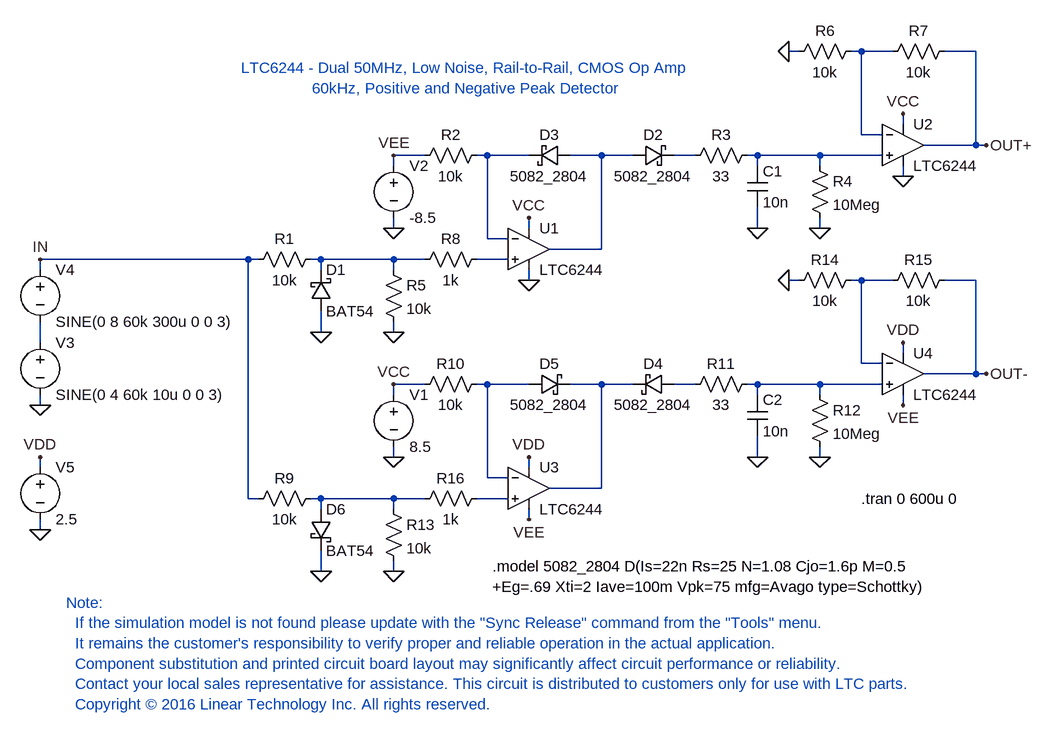
[diagram p0: schematic LTC6244_60kHz_PeakHold_Pos_and_Neg.asc]
LTC6244_60kHz_PeakHold_Pos_and_Neg.asc, the LTspice schematic file:
Version 4
SHEET 1 880 1728
WIRE -912 416 -928 416
WIRE -816 416 -832 416
WIRE -768 416 -816 416
WIRE -640 416 -688 416
WIRE -752 528 -752 512
WIRE -816 544 -816 416
WIRE -784 544 -816 544
WIRE -640 560 -640 416
WIRE -640 560 -720 560
WIRE -624 560 -640 560
WIRE -1488 576 -1536 576
WIRE -1392 576 -1408 576
WIRE -1328 576 -1392 576
WIRE -1216 576 -1264 576
WIRE -1168 576 -1216 576
WIRE -1072 576 -1104 576
WIRE -976 576 -992 576
WIRE -880 576 -976 576
WIRE -784 576 -880 576
WIRE -1536 592 -1536 576
WIRE -976 592 -976 576
WIRE -880 592 -880 576
WIRE -752 608 -752 592
WIRE -1536 688 -1536 672
WIRE -1328 688 -1328 672
WIRE -976 688 -976 656
WIRE -880 688 -880 672
WIRE -1392 704 -1392 576
WIRE -1360 704 -1392 704
WIRE -1216 720 -1216 576
WIRE -1216 720 -1296 720
WIRE -1760 736 -2080 736
WIRE -1744 736 -1760 736
WIRE -1648 736 -1664 736
WIRE -1536 736 -1648 736
WIRE -1488 736 -1536 736
WIRE -1360 736 -1408 736
WIRE -2080 752 -2080 736
WIRE -1648 752 -1648 736
WIRE -1536 752 -1536 736
WIRE -1328 768 -1328 752
WIRE -912 768 -928 768
WIRE -816 768 -832 768
WIRE -768 768 -816 768
WIRE -640 768 -688 768
WIRE -1648 848 -1648 816
WIRE -1536 848 -1536 832
WIRE -2080 864 -2080 832
WIRE -752 880 -752 864
WIRE -816 896 -816 768
WIRE -784 896 -816 896
WIRE -640 912 -640 768
WIRE -640 912 -720 912
WIRE -624 912 -640 912
WIRE -1488 928 -1536 928
WIRE -1392 928 -1408 928
WIRE -1328 928 -1392 928
WIRE -1216 928 -1264 928
WIRE -1168 928 -1216 928
WIRE -1072 928 -1104 928
WIRE -976 928 -992 928
WIRE -880 928 -976 928
WIRE -784 928 -880 928
WIRE -1536 944 -1536 928
WIRE -976 944 -976 928
WIRE -880 944 -880 928
WIRE -2080 960 -2080 944
WIRE -752 960 -752 944
WIRE -1536 1040 -1536 1024
WIRE -976 1040 -976 1008
WIRE -880 1040 -880 1024
WIRE -2080 1056 -2080 1040
WIRE -1328 1056 -1328 1040
WIRE -1392 1072 -1392 928
WIRE -1360 1072 -1392 1072
WIRE -1216 1088 -1216 928
WIRE -1216 1088 -1296 1088
WIRE -1760 1104 -1760 736
WIRE -1744 1104 -1760 1104
WIRE -1648 1104 -1664 1104
WIRE -1536 1104 -1648 1104
WIRE -1488 1104 -1536 1104
WIRE -1360 1104 -1408 1104
WIRE -1648 1120 -1648 1104
WIRE -1536 1120 -1536 1104
WIRE -1328 1136 -1328 1120
WIRE -2080 1152 -2080 1136
WIRE -1648 1216 -1648 1184
WIRE -1536 1216 -1536 1200
FLAG -1536 1040 0
FLAG -1328 768 0
FLAG -1328 672 VCC
FLAG -2080 960 0
FLAG -1648 848 0
FLAG -1536 848 0
FLAG -976 688 0
FLAG -880 688 0
FLAG -1536 576 VEE
FLAG -752 608 0
FLAG -752 512 VCC
FLAG -928 416 0
FLAG -1648 1216 0
FLAG -1536 1216 0
FLAG -976 1040 0
FLAG -880 1040 0
FLAG -928 768 0
FLAG -1328 1136 VEE
FLAG -752 960 VEE
FLAG -1536 928 VCC
FLAG -624 560 OUT+
FLAG -624 912 OUT-
FLAG -2080 736 IN
FLAG -2080 1040 VDD
FLAG -1328 1040 VDD
FLAG -752 864 VDD
FLAG -1536 688 0
FLAG -2080 1152 0
SYMBOL voltage -1536 928 R0
WINDOW 123 24 138 Left 2
WINDOW 39 24 117 Left 2
SYMATTR InstName V1
SYMATTR Value 8.5
SYMBOL voltage -1536 576 R0
WINDOW 123 24 138 Left 2
WINDOW 39 24 117 Left 2
SYMATTR InstName V2
SYMATTR Value -8.5
SYMBOL voltage -2080 848 R0
WINDOW 123 0 0 Left 2
WINDOW 39 0 0 Left 2
SYMATTR InstName V3
SYMATTR Value SINE(0 4 60k 10u 0 0 3)
SYMBOL res -1648 720 R90
WINDOW 0 0 56 VBottom 2
WINDOW 3 32 56 VTop 2
SYMATTR InstName R1
SYMATTR Value 10k
SYMBOL LTC6244 -1328 720 R0
SYMATTR InstName U1
SYMBOL cap -992 592 R0
SYMATTR InstName C1
SYMATTR Value 10n
SYMBOL res -1392 560 R90
WINDOW 0 0 56 VBottom 2
WINDOW 3 32 56 VTop 2
SYMATTR InstName R2
SYMATTR Value 10k
SYMBOL res -976 560 R90
WINDOW 0 0 56 VBottom 2
WINDOW 3 32 56 VTop 2
SYMATTR InstName R3
SYMATTR Value 33
SYMBOL res -896 576 R0
SYMATTR InstName R4
SYMATTR Value 10Meg
SYMBOL schottky -1664 816 M180
WINDOW 0 24 64 Left 2
WINDOW 3 24 0 Left 2
SYMATTR InstName D1
SYMATTR Value BAT54
SYMATTR Description Diode
SYMATTR Type diode
SYMBOL schottky -1168 592 R270
WINDOW 0 32 32 VTop 2
WINDOW 3 0 32 VBottom 2
SYMATTR InstName D2
SYMATTR Value 5082_2804
SYMATTR Description Diode
SYMATTR Type diode
SYMBOL schottky -1264 560 R90
WINDOW 0 0 32 VBottom 2
WINDOW 3 32 32 VTop 2
SYMATTR InstName D3
SYMATTR Value 5082_2804
SYMATTR Description Diode
SYMATTR Type diode
SYMBOL res -1552 736 R0
SYMATTR InstName R5
SYMATTR Value 10k
SYMBOL LTC6244 -752 560 R0
SYMATTR InstName U2
SYMBOL res -816 400 R90
WINDOW 0 0 56 VBottom 2
WINDOW 3 32 56 VTop 2
SYMATTR InstName R6
SYMATTR Value 10k
SYMBOL res -672 400 R90
WINDOW 0 0 56 VBottom 2
WINDOW 3 32 56 VTop 2
SYMATTR InstName R7
SYMATTR Value 10k
SYMBOL res -1504 752 R270
WINDOW 0 32 56 VTop 2
WINDOW 3 0 56 VBottom 2
SYMATTR InstName R8
SYMATTR Value 1k
SYMBOL voltage -2080 736 R0
WINDOW 123 0 0 Left 2
WINDOW 39 0 0 Left 2
SYMATTR InstName V4
SYMATTR Value SINE(0 8 60k 300u 0 0 3)
SYMBOL res -1648 1088 R90
WINDOW 0 0 56 VBottom 2
WINDOW 3 32 56 VTop 2
SYMATTR InstName R9
SYMATTR Value 10k
SYMBOL cap -992 944 R0
SYMATTR InstName C2
SYMATTR Value 10n
SYMBOL res -1392 912 R90
WINDOW 0 0 56 VBottom 2
WINDOW 3 32 56 VTop 2
SYMATTR InstName R10
SYMATTR Value 10k
SYMBOL res -976 912 R90
WINDOW 0 0 56 VBottom 2
WINDOW 3 32 56 VTop 2
SYMATTR InstName R11
SYMATTR Value 33
SYMBOL res -896 928 R0
SYMATTR InstName R12
SYMATTR Value 10Meg
SYMBOL schottky -1104 912 R90
WINDOW 0 0 32 VBottom 2
WINDOW 3 32 32 VTop 2
SYMATTR InstName D4
SYMATTR Value 5082_2804
SYMATTR Description Diode
SYMATTR Type diode
SYMBOL schottky -1328 944 R270
WINDOW 0 32 32 VTop 2
WINDOW 3 0 32 VBottom 2
SYMATTR InstName D5
SYMATTR Value 5082_2804
SYMATTR Description Diode
SYMATTR Type diode
SYMBOL res -1552 1104 R0
SYMATTR InstName R13
SYMATTR Value 10k
SYMBOL res -816 752 R90
WINDOW 0 0 56 VBottom 2
WINDOW 3 32 56 VTop 2
SYMATTR InstName R14
SYMATTR Value 10k
SYMBOL res -672 752 R90
WINDOW 0 0 56 VBottom 2
WINDOW 3 32 56 VTop 2
SYMATTR InstName R15
SYMATTR Value 10k
SYMBOL res -1504 1120 R270
WINDOW 0 32 56 VTop 2
WINDOW 3 0 56 VBottom 2
SYMATTR InstName R16
SYMATTR Value 1k
SYMBOL schottky -1664 1120 R0
SYMATTR InstName D6
SYMATTR Value BAT54
SYMATTR Description Diode
SYMATTR Type diode
SYMBOL LTC6244 -1328 1088 R0
SYMATTR InstName U3
SYMBOL LTC6244 -752 912 R0
SYMATTR InstName U4
SYMBOL voltage -2080 1040 R0
WINDOW 123 0 0 Left 2
WINDOW 39 0 0 Left 2
SYMATTR InstName V5
SYMATTR Value 2.5
TEXT -816 1104 Left 2 !.tran 0 600u 0
TEXT -1384 1208 Left 2 !.model 5082_2804 D(Is=22n Rs=25 N=1.08 Cjo=1.6p M=0.5 \n+Eg=.69 Xti=2 Iave=100m Vpk=75 mfg=Avago type=Schottky)
TEXT -2040 1264 Left 2 ;Note:\n  If the simulation model is not found please update with the "Sync Release" command from the "Tools" menu.\n  It remains the customer's responsibility to verify proper and reliable operation in the actual application.\n  Component substitution and printed circuit board layout may significantly affect circuit performance or reliability.\n  Contact your local sales representative for assistance. This circuit is distributed to customers only for use with LTC parts.\n  Copyright © 2016 Linear Technology Inc. All rights reserved.
TEXT -1424 488 Bottom 2 ;LTC6244 - Dual 50MHz, Low Noise, Rail-to-Rail, CMOS Op Amp\n60kHz, Positive and Negative Peak Detector

The netlist it stands for:
* LTC6244_60kHz_PeakHold_Pos_and_Neg.asc
V1 VCC 0 8.5
V2 VEE 0 -8.5
V3 N009 0 SINE(0 4 60k 10u 0 0 3)
R1 N006 IN 10k
XU1 N007 N002 VCC 0 N003 LTC6244  ; pins In+ In- V+ V- OUT
C1 N005 0 10n
R2 N002 VEE 10k
R3 N005 N004 33
R4 N005 0 10Meg
D1 0 N006 BAT54
D2 N003 N004 5082_2804
D3 N003 N002 5082_2804
R5 N006 0 10k
XU2 N005 N001 VCC 0 OUT+ LTC6244  ; pins In+ In- V+ V- OUT
R6 N001 0 10k
R7 OUT+ N001 10k
R8 N006 N007 1k
V4 IN N009 SINE(0 8 60k 300u 0 0 3)
R9 N014 IN 10k
C2 N013 0 10n
R10 N010 VCC 10k
R11 N013 N012 33
R12 N013 0 10Meg
D4 N012 N011 5082_2804
D5 N010 N011 5082_2804
R13 N014 0 10k
R14 N008 0 10k
R15 OUT- N008 10k
R16 N014 N015 1k
D6 N014 0 BAT54
XU3 N015 N010 VDD VEE N011 LTC6244  ; pins In+ In- V+ V- OUT
XU4 N013 N008 VDD VEE OUT- LTC6244  ; pins In+ In- V+ V- OUT
V5 VDD 0 2.5
.model D D
.lib standard.dio
.tran 0 600u 0
.model 5082_2804 D(Is=22n Rs=25 N=1.08 Cjo=1.6p M=0.5
+Eg=.69 Xti=2 Iave=100m Vpk=75 mfg=Avago type=Schottky)
* Note:
*   If the simulation model is not found please update with the "Sync Release" command from the "Tools" menu.
*   It remains the customer's responsibility to verify proper and reliable operation in the actual application.
*   Component substitution and printed circuit board layout may significantly affect circuit performance or reliability.
*   Contact your local sales representative for assistance. This circuit is distributed to customers only for use with LTC parts.
*   Copyright © 2016 Linear Technology Inc. All rights reserved.
* LTC6244 - Dual 50MHz, Low Noise, Rail-to-Rail, CMOS Op Amp
* 60kHz, Positive and Negative Peak Detector
.backanno
.end